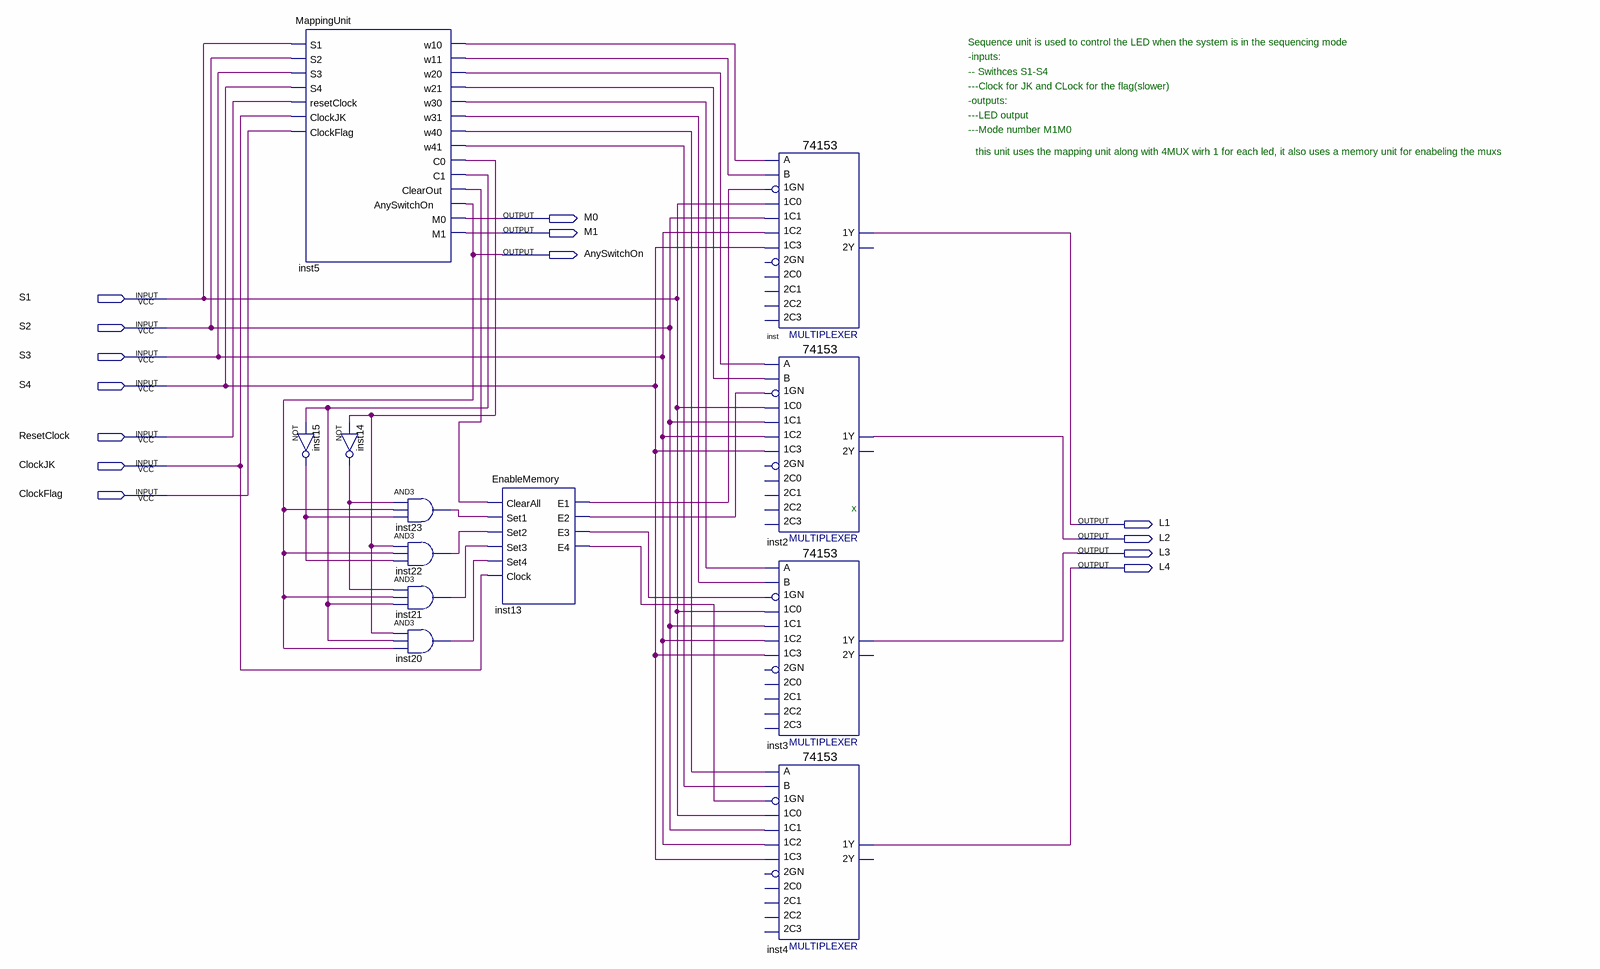
[diagram p0: schematic sheet]
// Quartus schematic SequenceUnit.bdf as structural Verilog: 12 symbols, 14 pins
module SequenceUnit (
  input  S1,
  input  S2,
  input  S3,
  input  S4,
  input  ResetClock,
  input  ClockJK,
  input  ClockFlag,
  output M0,
  output M1,
  output AnySwitchOn,
  output L1,
  output L2,
  output L3,
  output L4
);

  wire inst5_c0, inst5_c1, inst5_clearout, inst5_w10, inst5_w11, inst5_w20, inst5_w21, inst5_w30, inst5_w31,
       inst5_w40, inst5_w41, inst13_e1, inst13_e2, inst13_e3, inst13_e4, inst14_out, inst15_out, inst20_out,
       inst21_out, inst22_out, inst23_out;

  MappingUnit inst5 (
    .S1(S1), .S2(S2), .S3(S3), .S4(S4), .resetClock(ResetClock), .ClockJK(ClockJK), .ClockFlag(ClockFlag),
    .w10(inst5_w10), .w11(inst5_w11), .w20(inst5_w20), .w21(inst5_w21), .w30(inst5_w30), .w31(inst5_w31),
    .w40(inst5_w40), .w41(inst5_w41), .C0(inst5_c0), .C1(inst5_c1), .ClearOut(inst5_clearout),
    .AnySwitchOn(AnySwitchOn), .M0(M0), .M1(M1));
  not inst14 (inst14_out, inst5_c0);
  not inst15 (inst15_out, inst5_c1);
  and inst23 (inst23_out, inst14_out, AnySwitchOn, inst15_out);
  and inst22 (inst22_out, inst5_c0, AnySwitchOn, inst15_out);
  and inst21 (inst21_out, inst14_out, AnySwitchOn, inst5_c1);
  and inst20 (inst20_out, inst5_c0, inst5_c1, AnySwitchOn);
  EnableMemory inst13 (
    .ClearAll(inst5_clearout), .Set1(inst23_out), .Set2(inst22_out), .Set3(inst21_out), .Set4(inst20_out),
    .Clock(ClockJK), .E1(inst13_e1), .E2(inst13_e2), .E3(inst13_e3), .E4(inst13_e4));
  \74153  inst (
    .\1C1 (S2), .\1GN (inst13_e1), .\1C0 (S1), .\1C2 (S3), .\1C3 (S4), .B(inst5_w11), .A(inst5_w10), .\1Y (L1));  // open: 2C0, 2GN, 2C2, 2C1, 2C3, 2Y
  \74153  inst2 (
    .\1C1 (S2), .\1GN (inst13_e2), .\1C0 (S1), .\1C2 (S3), .\1C3 (S4), .B(inst5_w21), .A(inst5_w20), .\1Y (L2));  // open: 2C0, 2GN, 2C2, 2C1, 2C3, 2Y
  \74153  inst3 (
    .\1C1 (S2), .\1GN (inst13_e3), .\1C0 (S1), .\1C2 (S3), .\1C3 (S4), .B(inst5_w31), .A(inst5_w30), .\1Y (L3));  // open: 2C0, 2GN, 2C2, 2C1, 2C3, 2Y
  \74153  inst4 (
    .\1C1 (S2), .\1GN (inst13_e4), .\1C0 (S1), .\1C2 (S3), .\1C3 (S4), .B(inst5_w41), .A(inst5_w40), .\1Y (L4));  // open: 2C0, 2GN, 2C2, 2C1, 2C3, 2Y

  // Notes on the sheet:
  //   Sequence unit is used to control the LED when the system is in the sequencing mode
  //   -inputs:
  //   -- Swithces S1-S4
  //   ---Clock for JK and CLock for the flag(slower)
  //   -outputs:
  //   ---LED output
  //   ---Mode number M1M0
  //   this unit uses the mapping unit along with 4MUX wirh 1 for each led, it also uses a memory unit for enabeling the muxs
  //   x
endmodule
